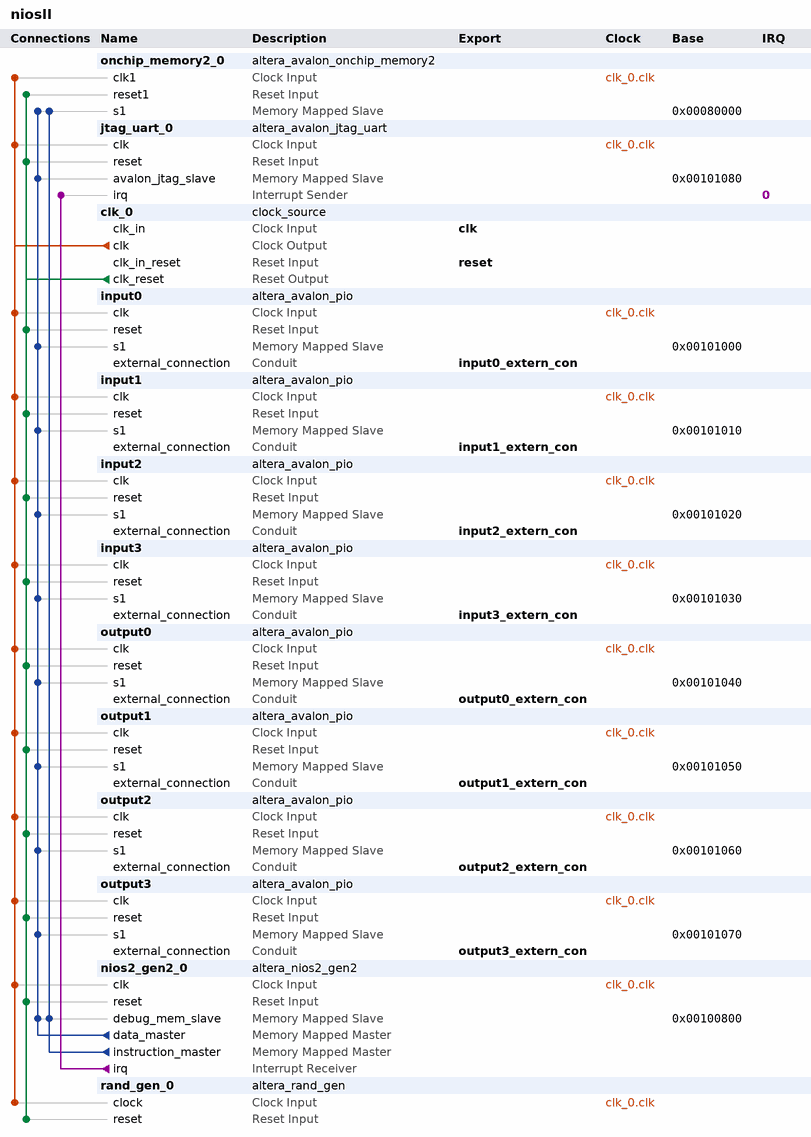
[diagram p0: system contents]
# Platform Designer (Qsys) system niosII, Stratix IV EP4SGX230KF40C2
# Parameters at their usual value, and those the tool derives, are not listed.
package require -exact qsys 16.1
create_system niosII
set_project_property DEVICE_FAMILY {Stratix IV}
set_project_property DEVICE EP4SGX230KF40C2

add_instance onchip_memory2_0 altera_avalon_onchip_memory2 16.1
set_instance_parameter_value onchip_memory2_0 dataWidth 32
set_instance_parameter_value onchip_memory2_0 dualPort false
set_instance_parameter_value onchip_memory2_0 initMemContent true
set_instance_parameter_value onchip_memory2_0 initializationFileName onchip_memory2_0
set_instance_parameter_value onchip_memory2_0 memorySize 204800

add_instance jtag_uart_0 altera_avalon_jtag_uart 16.1
set_instance_parameter_value jtag_uart_0 simInteractiveOptions INTERACTIVE_ASCII_OUTPUT

add_instance clk_0 clock_source 16.1
set_instance_parameter_value clk_0 clockFrequency 200000000

add_instance input0 altera_avalon_pio 16.1
set_instance_parameter_value input0 direction Input
set_instance_parameter_value input0 width 32

add_instance input1 altera_avalon_pio 16.1
set_instance_parameter_value input1 direction Input
set_instance_parameter_value input1 width 32

add_instance input2 altera_avalon_pio 16.1
set_instance_parameter_value input2 direction Input
set_instance_parameter_value input2 width 32

add_instance input3 altera_avalon_pio 16.1
set_instance_parameter_value input3 direction Input
set_instance_parameter_value input3 width 32

add_instance output0 altera_avalon_pio 16.1
set_instance_parameter_value output0 direction Output
set_instance_parameter_value output0 width 32

add_instance output1 altera_avalon_pio 16.1
set_instance_parameter_value output1 direction Output
set_instance_parameter_value output1 width 32

add_instance output2 altera_avalon_pio 16.1
set_instance_parameter_value output2 direction Output
set_instance_parameter_value output2 width 32

add_instance output3 altera_avalon_pio 16.1
set_instance_parameter_value output3 direction Output
set_instance_parameter_value output3 width 32

add_instance nios2_gen2_0 altera_nios2_gen2 16.1
set_instance_parameter_value nios2_gen2_0 dcache_size 2048
set_instance_parameter_value nios2_gen2_0 exceptionSlave onchip_memory2_0.s1
set_instance_parameter_value nios2_gen2_0 icache_size 4096
set_instance_parameter_value nios2_gen2_0 impl Tiny
set_instance_parameter_value nios2_gen2_0 resetSlave onchip_memory2_0.s1

add_instance rand_gen_0 altera_rand_gen 16.1
set_instance_parameter_value rand_gen_0 GEN_TYPE 1
set_instance_parameter_value rand_gen_0 IS_TESTING false
set_instance_parameter_value rand_gen_0 MODEL_OPTION 1
set_instance_parameter_value rand_gen_0 SEED_GEN Auto
set_instance_parameter_value rand_gen_0 SEED_VALUE 68997764
set_instance_parameter_value rand_gen_0 design_env QSYS
set_instance_parameter_value rand_gen_0 selected_device_family {Stratix IV}

# connections
add_connection clk_0.clk input0.clk clock
add_connection clk_0.clk input1.clk clock
add_connection clk_0.clk input2.clk clock
add_connection clk_0.clk input3.clk clock
add_connection clk_0.clk jtag_uart_0.clk clock
add_connection clk_0.clk nios2_gen2_0.clk clock
add_connection clk_0.clk onchip_memory2_0.clk1 clock
add_connection clk_0.clk output0.clk clock
add_connection clk_0.clk output1.clk clock
add_connection clk_0.clk output2.clk clock
add_connection clk_0.clk output3.clk clock
add_connection clk_0.clk rand_gen_0.clock clock
add_connection clk_0.clk_reset input0.reset reset
add_connection clk_0.clk_reset input1.reset reset
add_connection clk_0.clk_reset input2.reset reset
add_connection clk_0.clk_reset input3.reset reset
add_connection clk_0.clk_reset jtag_uart_0.reset reset
add_connection clk_0.clk_reset nios2_gen2_0.reset reset
add_connection clk_0.clk_reset onchip_memory2_0.reset1 reset
add_connection clk_0.clk_reset output0.reset reset
add_connection clk_0.clk_reset output1.reset reset
add_connection clk_0.clk_reset output2.reset reset
add_connection clk_0.clk_reset output3.reset reset
add_connection clk_0.clk_reset rand_gen_0.reset reset
add_connection nios2_gen2_0.data_master input0.s1 avalon
set_connection_parameter_value nios2_gen2_0.data_master/input0.s1 baseAddress 0x00101000
add_connection nios2_gen2_0.data_master input1.s1 avalon
set_connection_parameter_value nios2_gen2_0.data_master/input1.s1 baseAddress 0x00101010
add_connection nios2_gen2_0.data_master input2.s1 avalon
set_connection_parameter_value nios2_gen2_0.data_master/input2.s1 baseAddress 0x00101020
add_connection nios2_gen2_0.data_master input3.s1 avalon
set_connection_parameter_value nios2_gen2_0.data_master/input3.s1 baseAddress 0x00101030
add_connection nios2_gen2_0.data_master jtag_uart_0.avalon_jtag_slave avalon
set_connection_parameter_value nios2_gen2_0.data_master/jtag_uart_0.avalon_jtag_slave baseAddress 0x00101080
add_connection nios2_gen2_0.data_master nios2_gen2_0.debug_mem_slave avalon
set_connection_parameter_value nios2_gen2_0.data_master/nios2_gen2_0.debug_mem_slave baseAddress 0x00100800
add_connection nios2_gen2_0.data_master onchip_memory2_0.s1 avalon
set_connection_parameter_value nios2_gen2_0.data_master/onchip_memory2_0.s1 baseAddress 0x00080000
add_connection nios2_gen2_0.data_master output0.s1 avalon
set_connection_parameter_value nios2_gen2_0.data_master/output0.s1 baseAddress 0x00101040
add_connection nios2_gen2_0.data_master output1.s1 avalon
set_connection_parameter_value nios2_gen2_0.data_master/output1.s1 baseAddress 0x00101050
add_connection nios2_gen2_0.data_master output2.s1 avalon
set_connection_parameter_value nios2_gen2_0.data_master/output2.s1 baseAddress 0x00101060
add_connection nios2_gen2_0.data_master output3.s1 avalon
set_connection_parameter_value nios2_gen2_0.data_master/output3.s1 baseAddress 0x00101070
add_connection nios2_gen2_0.instruction_master nios2_gen2_0.debug_mem_slave avalon
set_connection_parameter_value nios2_gen2_0.instruction_master/nios2_gen2_0.debug_mem_slave baseAddress 0x00100800
add_connection nios2_gen2_0.instruction_master onchip_memory2_0.s1 avalon
set_connection_parameter_value nios2_gen2_0.instruction_master/onchip_memory2_0.s1 baseAddress 0x00080000
add_connection nios2_gen2_0.irq jtag_uart_0.irq interrupt
set_connection_parameter_value nios2_gen2_0.irq/jtag_uart_0.irq irqNumber 0

# exported interfaces
add_interface clk clock sink
set_interface_property clk EXPORT_OF clk_0.clk_in
add_interface input0_extern_con conduit end
set_interface_property input0_extern_con EXPORT_OF input0.external_connection
add_interface input1_extern_con conduit end
set_interface_property input1_extern_con EXPORT_OF input1.external_connection
add_interface input2_extern_con conduit end
set_interface_property input2_extern_con EXPORT_OF input2.external_connection
add_interface input3_extern_con conduit end
set_interface_property input3_extern_con EXPORT_OF input3.external_connection
add_interface output0_extern_con conduit end
set_interface_property output0_extern_con EXPORT_OF output0.external_connection
add_interface output1_extern_con conduit end
set_interface_property output1_extern_con EXPORT_OF output1.external_connection
add_interface output2_extern_con conduit end
set_interface_property output2_extern_con EXPORT_OF output2.external_connection
add_interface output3_extern_con conduit end
set_interface_property output3_extern_con EXPORT_OF output3.external_connection
add_interface reset reset sink
set_interface_property reset EXPORT_OF clk_0.clk_in_reset

set_interconnect_requirement {$system} qsys_mm.clockCrossingAdapter HANDSHAKE
set_interconnect_requirement {$system} qsys_mm.maxAdditionalLatency 0

save_system niosII.qsys
